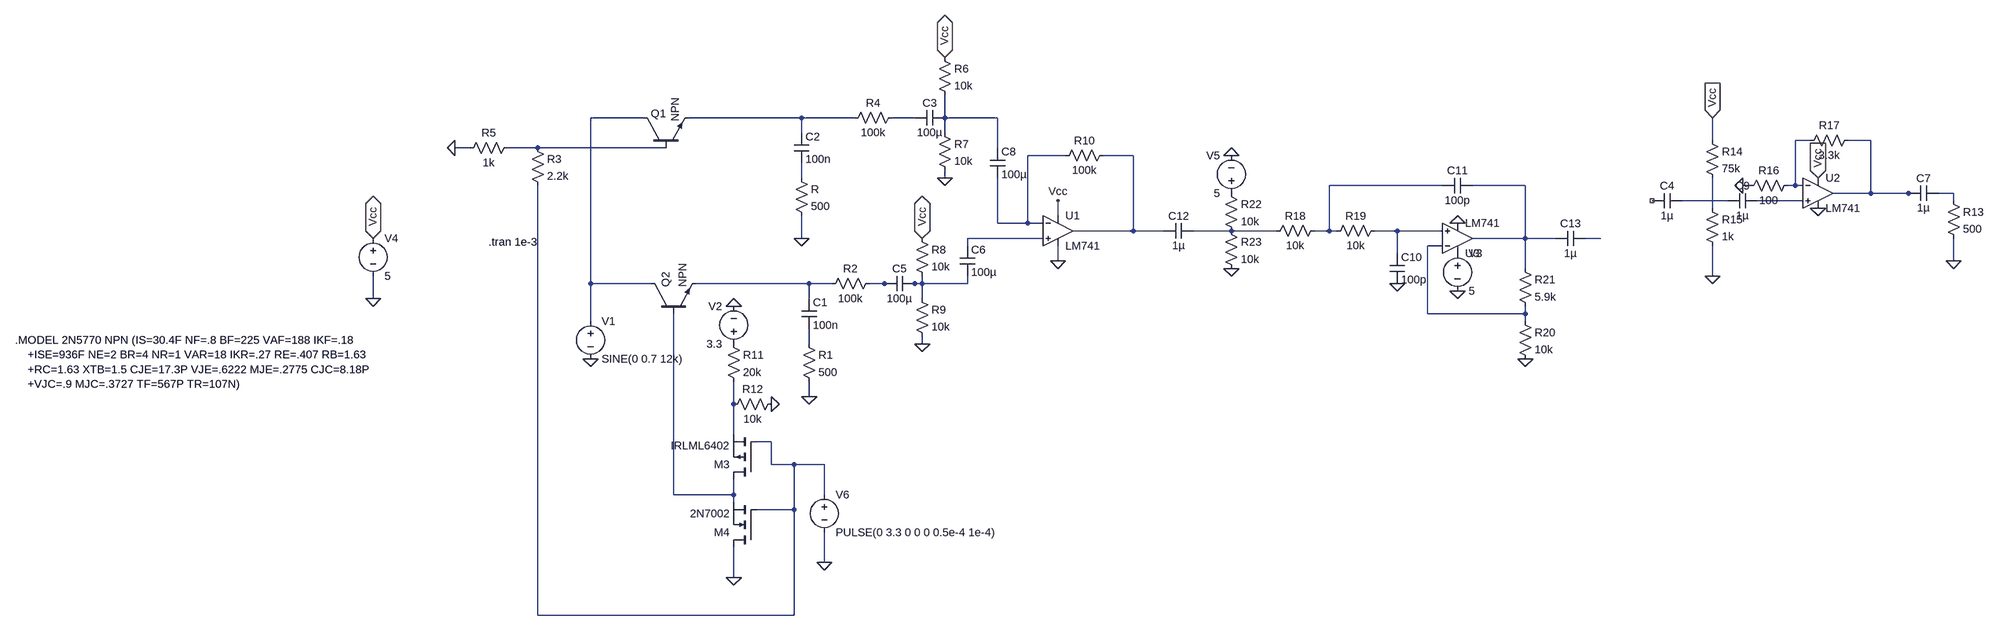
[diagram p0: schematic IQmixer.asc]
IQmixer.asc, the LTspice schematic file:
Version 4.1
SHEET 1 3124 756
WIRE 160 -304 48 -304
WIRE 496 -304 256 -304
WIRE 608 -304 496 -304
WIRE 736 -304 688 -304
WIRE 800 -304 800 -352
WIRE 912 -304 800 -304
WIRE 496 -272 496 -304
WIRE 800 -272 800 -304
WIRE 2544 -256 2544 -304
WIRE 2752 -256 2720 -256
WIRE 2880 -256 2832 -256
WIRE -208 -240 -240 -240
WIRE -64 -240 -128 -240
WIRE 208 -240 -64 -240
WIRE 912 -240 912 -304
WIRE 1056 -224 976 -224
WIRE 1200 -224 1136 -224
WIRE 496 -176 496 -208
WIRE 800 -176 800 -192
WIRE 1856 -160 1616 -160
WIRE 2032 -160 1920 -160
WIRE 2624 -160 2608 -160
WIRE 2720 -160 2720 -256
WIRE 2720 -160 2704 -160
WIRE 2736 -160 2720 -160
WIRE 2880 -144 2880 -256
WIRE 2880 -144 2800 -144
WIRE 2960 -144 2880 -144
WIRE 2976 -144 2960 -144
WIRE 3056 -144 3024 -144
WIRE 2576 -128 2480 -128
WIRE 2736 -128 2640 -128
WIRE 3056 -128 3056 -144
WIRE 2544 -112 2544 -176
WIRE 1040 -96 1040 -128
WIRE 912 -80 912 -176
WIRE 976 -80 976 -224
WIRE 976 -80 912 -80
WIRE 1008 -80 976 -80
WIRE 1200 -64 1200 -224
WIRE 1200 -64 1072 -64
WIRE 1264 -64 1200 -64
WIRE 1408 -64 1328 -64
WIRE 1504 -64 1408 -64
WIRE 1616 -64 1616 -160
WIRE 1616 -64 1584 -64
WIRE 1632 -64 1616 -64
WIRE 1760 -64 1712 -64
WIRE 1856 -64 1760 -64
WIRE 496 -48 496 -96
WIRE 1008 -48 848 -48
WIRE 2032 -48 2032 -160
WIRE 2032 -48 1920 -48
WIRE 2096 -48 2032 -48
WIRE 2192 -48 2160 -48
WIRE 848 -32 848 -48
WIRE 1856 -32 1824 -32
WIRE 1760 -16 1760 -64
WIRE 1040 0 1040 -32
WIRE 3056 0 3056 -48
WIRE 2032 16 2032 -48
WIRE 2544 32 2544 -32
WIRE 48 48 48 -304
WIRE 176 48 48 48
WIRE 512 48 272 48
WIRE 560 48 512 48
WIRE 672 48 640 48
WIRE 688 48 672 48
WIRE 736 48 720 48
WIRE 752 48 752 32
WIRE 752 48 736 48
WIRE 848 48 848 32
WIRE 848 48 752 48
WIRE -480 80 -480 32
WIRE 512 80 512 48
WIRE 752 80 752 48
WIRE 1824 112 1824 -32
WIRE 2032 112 2032 96
WIRE 2032 112 1824 112
WIRE 48 128 48 48
WIRE 2032 128 2032 112
WIRE 512 176 512 144
WIRE 752 176 752 160
WIRE 512 288 512 256
WIRE 352 304 352 256
WIRE 352 368 352 304
WIRE 432 384 400 384
WIRE 432 432 432 384
WIRE 480 432 432 432
WIRE 544 432 480 432
WIRE 224 496 224 112
WIRE 352 496 352 464
WIRE 352 496 224 496
WIRE 544 496 544 432
WIRE 352 512 352 496
WIRE 480 528 480 432
WIRE 480 528 400 528
WIRE 544 640 544 576
WIRE 352 672 352 608
WIRE -64 752 -64 -160
WIRE 480 752 480 528
WIRE 480 752 -64 752
FLAG 48 208 0
FLAG 544 640 0
FLAG 352 672 0
FLAG 496 -48 0
FLAG 512 288 0
FLAG -480 80 0
FLAG -480 -48 Vcc
IOPIN -480 -48 BiDir
FLAG 1040 0 0
FLAG 800 -176 0
FLAG 752 176 0
FLAG 800 -432 Vcc
IOPIN 800 -432 BiDir
FLAG 752 -48 Vcc
IOPIN 752 -48 BiDir
FLAG 1040 -128 Vcc
FLAG -240 -240 0
FLAG 2768 -176 Vcc
IOPIN 2768 -176 In
FLAG 2768 -112 0
FLAG 2544 -304 Vcc
IOPIN 2544 -304 In
FLAG 2544 32 0
FLAG 3056 0 0
FLAG 2608 -160 0
FLAG 1888 -80 0
FLAG 2032 208 0
FLAG 1760 48 0
FLAG 1888 64 0
FLAG 1408 -224 0
FLAG 1408 16 0
FLAG 432 304 0
FLAG 352 96 0
SYMBOL voltage 48 112 R0
WINDOW 123 0 0 Left 0
WINDOW 39 0 0 Left 0
SYMATTR InstName V1
SYMATTR Value SINE(0 0.7 12k)
SYMBOL voltage 544 480 R0
WINDOW 123 0 0 Left 0
WINDOW 39 0 0 Left 0
SYMATTR InstName V6
SYMATTR Value PULSE(0 3.3 0 0 0 0.5e-4 1e-4)
SYMBOL pmos 400 464 R180
SYMATTR InstName M3
SYMATTR Value IRLML6402
SYMBOL nmos 400 608 R180
SYMATTR InstName M4
SYMATTR Value 2N7002
SYMBOL cap 496 80 R0
SYMATTR InstName C1
SYMATTR Value 100n
SYMBOL res 496 160 R0
SYMATTR InstName R1
SYMATTR Value 500
SYMBOL cap 480 -272 R0
SYMATTR InstName C2
SYMATTR Value 100n
SYMBOL res 480 -192 R0
SYMATTR InstName R
SYMATTR Value 500
SYMBOL voltage -480 -64 R0
WINDOW 123 0 0 Left 0
WINDOW 39 0 0 Left 0
SYMATTR InstName V4
SYMATTR Value 5
SYMBOL res 784 -448 R0
SYMATTR InstName R6
SYMATTR Value 10k
SYMBOL res 784 -288 R0
SYMATTR InstName R7
SYMATTR Value 10k
SYMBOL res 736 -64 R0
SYMATTR InstName R8
SYMATTR Value 10k
SYMBOL res 736 64 R0
SYMATTR InstName R9
SYMATTR Value 10k
SYMBOL LM741 1040 -128 R0
SYMATTR InstName U1
SYMBOL res 704 -320 R90
WINDOW 0 0 56 VBottom 2
WINDOW 3 32 56 VTop 2
SYMATTR InstName R4
SYMATTR Value 100k
SYMBOL cap 800 -320 R90
WINDOW 0 0 32 VBottom 2
WINDOW 3 32 32 VTop 2
SYMATTR InstName C3
SYMATTR Value 100µ
SYMBOL cap 736 32 R90
WINDOW 0 0 32 VBottom 2
WINDOW 3 32 32 VTop 2
SYMATTR InstName C5
SYMATTR Value 100µ
SYMBOL res 656 32 R90
WINDOW 0 0 56 VBottom 2
WINDOW 3 32 56 VTop 2
SYMATTR InstName R2
SYMATTR Value 100k
SYMBOL res 1152 -240 R90
WINDOW 0 0 56 VBottom 2
WINDOW 3 32 56 VTop 2
SYMATTR InstName R10
SYMATTR Value 100k
SYMBOL res -80 -256 R0
SYMATTR InstName R3
SYMATTR Value 2.2k
SYMBOL res -112 -256 R90
WINDOW 0 0 56 VBottom 2
WINDOW 3 32 56 VTop 2
SYMATTR InstName R5
SYMATTR Value 1k
SYMBOL LM741 2768 -208 R0
SYMATTR InstName U2
SYMBOL res 2528 -272 R0
SYMATTR InstName R14
SYMATTR Value 75k
SYMBOL res 2528 -128 R0
SYMATTR InstName R15
SYMATTR Value 1k
SYMBOL cap 2480 -144 R90
WINDOW 0 0 32 VBottom 2
WINDOW 3 32 32 VTop 2
SYMATTR InstName C4
SYMATTR Value 1µ
SYMBOL cap 3024 -160 R90
WINDOW 0 0 32 VBottom 2
WINDOW 3 32 32 VTop 2
SYMATTR InstName C7
SYMATTR Value 1µ
SYMBOL res 3040 -144 R0
SYMATTR InstName R13
SYMATTR Value 500
SYMBOL res 2720 -176 R90
WINDOW 0 0 56 VBottom 2
WINDOW 3 32 56 VTop 2
SYMATTR InstName R16
SYMATTR Value 100
SYMBOL res 2848 -272 R90
WINDOW 0 0 56 VBottom 2
WINDOW 3 32 56 VTop 2
SYMATTR InstName R17
SYMATTR Value 3.3k
SYMBOL cap 832 -32 R0
SYMATTR InstName C6
SYMATTR Value 100µ
SYMBOL cap 896 -240 R0
SYMATTR InstName C8
SYMATTR Value 100µ
SYMBOL cap 2640 -144 R90
WINDOW 0 0 32 VBottom 2
WINDOW 3 32 32 VTop 2
SYMATTR InstName C9
SYMATTR Value 1µ
SYMBOL res 1600 -80 R90
WINDOW 0 0 56 VBottom 2
WINDOW 3 32 56 VTop 2
SYMATTR InstName R18
SYMATTR Value 10k
SYMBOL res 1728 -80 R90
WINDOW 0 0 56 VBottom 2
WINDOW 3 32 56 VTop 2
SYMATTR InstName R19
SYMATTR Value 10k
SYMBOL cap 1744 -16 R0
SYMATTR InstName C10
SYMATTR Value 100p
SYMBOL LM741 1888 16 M180
SYMATTR InstName U3
SYMBOL voltage 1888 -32 R0
WINDOW 123 0 0 Left 0
WINDOW 39 0 0 Left 0
SYMATTR InstName V3
SYMATTR Value 5
SYMBOL cap 1920 -176 R90
WINDOW 0 0 32 VBottom 2
WINDOW 3 32 32 VTop 2
SYMATTR InstName C11
SYMATTR Value 100p
SYMBOL res 2016 112 R0
SYMATTR InstName R20
SYMATTR Value 10k
SYMBOL res 2016 0 R0
SYMATTR InstName R21
SYMATTR Value 5.9k
SYMBOL cap 1328 -80 R90
WINDOW 0 0 32 VBottom 2
WINDOW 3 32 32 VTop 2
SYMATTR InstName C12
SYMATTR Value 1µ
SYMBOL res 1392 -160 R0
SYMATTR InstName R22
SYMATTR Value 10k
SYMBOL res 1392 -80 R0
SYMATTR InstName R23
SYMATTR Value 10k
SYMBOL voltage 1408 -128 R180
WINDOW 0 24 96 Left 2
WINDOW 3 24 16 Left 2
WINDOW 123 0 0 Left 0
WINDOW 39 0 0 Left 0
SYMATTR InstName V5
SYMATTR Value 5
SYMBOL cap 2160 -64 R90
WINDOW 0 0 32 VBottom 2
WINDOW 3 32 32 VTop 2
SYMATTR InstName C13
SYMATTR Value 1µ
SYMBOL voltage 352 192 R180
WINDOW 0 24 96 Left 2
WINDOW 3 24 16 Left 2
WINDOW 123 0 0 Left 0
WINDOW 39 0 0 Left 0
SYMATTR InstName V2
SYMATTR Value 3.3
SYMBOL res 336 160 R0
SYMATTR InstName R11
SYMATTR Value 20k
SYMBOL res 448 288 R90
WINDOW 0 0 56 VBottom 2
WINDOW 3 32 56 VTop 2
SYMATTR InstName R12
SYMATTR Value 10k
SYMBOL npn 160 -240 R270
WINDOW 0 73 16 VRight 2
SYMATTR InstName Q1
SYMBOL npn 176 112 R270
SYMATTR InstName Q2
TEXT -168 -40 Left 2 !.tran 1e-3
TEXT -1240 168 Left 2 !.MODEL 2N5770 NPN (IS=30.4F NF=.8 BF=225 VAF=188 IKF=.18\n    +ISE=936F NE=2 BR=4 NR=1 VAR=18 IKR=.27 RE=.407 RB=1.63\n    +RC=1.63 XTB=1.5 CJE=17.3P VJE=.6222 MJE=.2775 CJC=8.18P \n    +VJC=.9 MJC=.3727 TF=567P TR=107N)

The netlist it stands for:
* IQmixer.asc
V1 N001 0 SINE(0 0.7 12k)
V6 N027 0 PULSE(0 3.3 0 0 0 0.5e-4 1e-4)
M3 N028 N027 N026 N026 IRLML6402
M4 0 N027 N028 N028 2N7002
C1 N022 N025 100n
R1 N025 0 500
C2 N002 N010 100n
R N010 0 500
V4 Vcc 0 5
R6 Vcc N004 10k
R7 N004 0 10k
R8 Vcc N024 10k
R9 N024 0 10k
X§U1 N019 N008 Vcc 0 N009 LM741  ; pins In+ In- V+ V- OUT
R4 N003 N002 100k
C3 N004 N003 100µ
C5 N024 N023 100µ
R2 N023 N022 100k
R10 N009 N008 100k
R3 N007 N027 2.2k
R5 N007 0 1k
X§U2 N015 N005 Vcc 0 N006 LM741  ; pins In+ In- V+ V- OUT
R14 Vcc N016 75k
R15 N016 0 1k
C4 N014 NC_01 1µ
C7 N013 N006 1µ
R13 N013 0 500
R16 N005 0 100
R17 N006 N005 3.3k
C6 N019 N024 100µ
C8 N004 N008 100µ
C9 N015 N014 1µ
R18 N011 N017 10k
R19 N018 N011 10k
C10 N018 0 100p
X§U3 N018 N021 P001 0 N012 LM741  ; pins In+ In- V+ V- OUT
V3 P001 0 5
C11 N012 N011 100p
R20 N021 0 10k
R21 N012 N021 5.9k
C12 N017 N009 1µ
R22 P002 N017 10k
R23 N017 0 10k
V5 P002 0 5
C13 N020 N012 1µ
V2 P003 0 3.3
R11 P003 N026 20k
R12 0 N026 10k
Q1 N001 N007 N002 0 NPN
Q2 N001 N028 N022 0 NPN
.model NPN NPN
.model PNP PNP
.lib standard.bjt
.model NMOS NMOS
.model PMOS PMOS
.lib standard.mos
.tran 1e-3
.MODEL 2N5770 NPN (IS=30.4F NF=.8 BF=225 VAF=188 IKF=.18
    +ISE=936F NE=2 BR=4 NR=1 VAR=18 IKR=.27 RE=.407 RB=1.63
    +RC=1.63 XTB=1.5 CJE=17.3P VJE=.6222 MJE=.2775 CJC=8.18P
    +VJC=.9 MJC=.3727 TF=567P TR=107N)
.lib LM741.lib
.backanno
.end